# Altium schematic sheet hud_v300_CONN.SchDoc
size A4; SheetNumber: 4; SheetTotal: 6
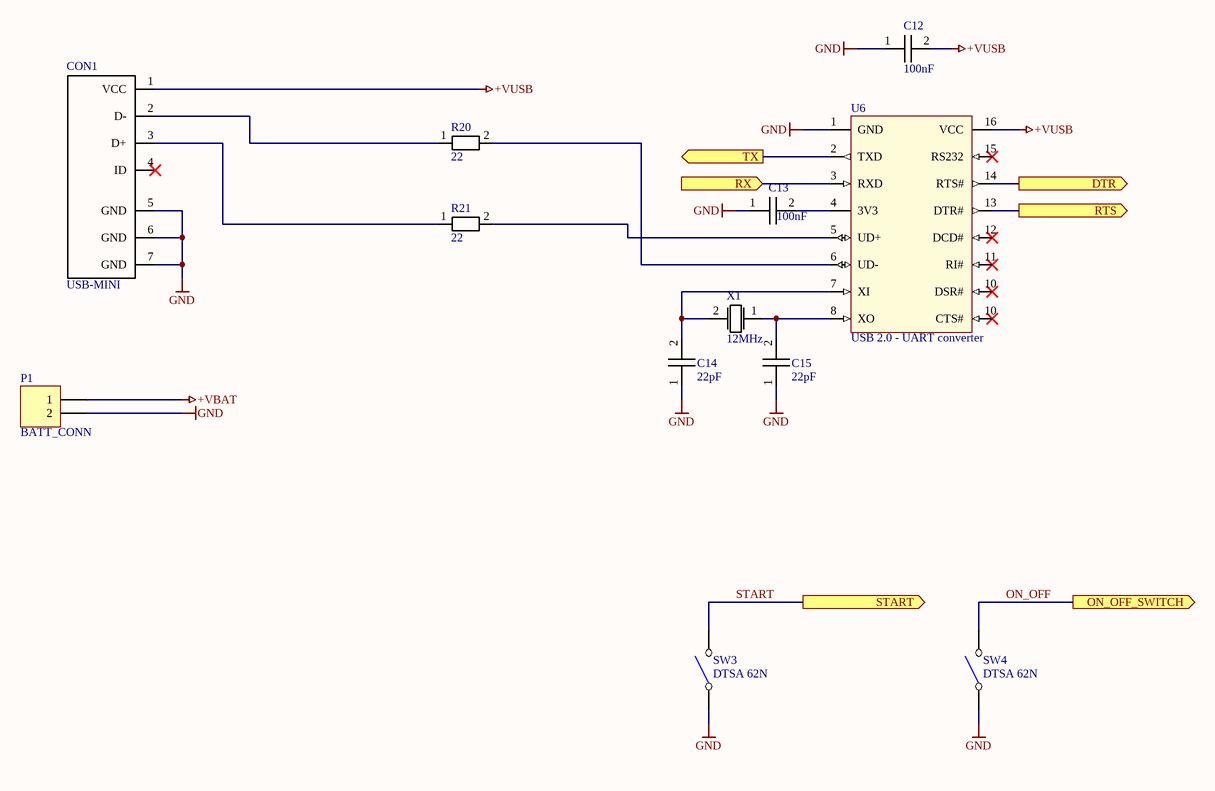
[diagram p0: hud_v300_CONN.SchDoc]

## Parts
C12  100nF  [0805_C]
C13  100nF  [0805_C]
C14  22pF  [0805_C]
C15  22pF  [0805_C]
CON1  USB-MINI  [USB-MINI]
P1  BATT_CONN  [HDR1X2]
R20  22  [0805]
R21  22  [0805]
SW3  DTSA 62N  [SW_DTSA-62N]
SW4  DTSA 62N  [SW_DTSA-62N]
U6  USB 2.0 - UART converter  [SOP127P660X265-16N]
X1  12MHz  [XTAL_SMALL]

## Ports
DTR (out, see hud_v300_MAIN[1B], hud_v300_MCU[2D]), ON_OFF_SWITCH (out, see hud_v300_MAIN[1A]), RTS (out, see hud_v300_MAIN[1B], hud_v300_MCU[2D]), RX (in, see hud_v300_MAIN[1B]), START (out, see hud_v300_MAIN[1B], hud_v300_MCU[4B]), TX (out, see hud_v300_MAIN[1B])

## Nets
+VBAT: P1.1
+VUSB: C12.2 CON1.1(VCC) U6.16(VCC)
GND: C12.1 C13.1 C14.1 C15.1 CON1.5(GND) CON1.6(GND) CON1.7(GND) P1.2 SW3.1 SW4.1 U6.1(GND)
DTR: U6.14(RTS#) ; port DTR
ON_OFF: SW4.2 ; port ON_OFF_SWITCH
RTS: U6.13(DTR#) ; port RTS
RX: U6.3(RXD) ; port RX
START: SW3.2 ; port START
TX: U6.2(TXD) ; port TX
NetC13_2: C13.2 U6.4(3V3)
NetC14_2: C14.2 U6.7(XI) X1.2
NetC15_2: C15.2 U6.8(XO) X1.1
NetCON1_2: CON1.2(D-) R20.1
NetCON1_3: CON1.3(D+) R21.1
NetR20_2: R20.2 U6.6(UD-)
NetR21_2: R21.2 U6.5(UD+)

Not connected (* = marked no-connect by the designer): CON1 4(ID)*; U6 10(DSR#)* 11(RI#)* 12(DCD#)* 15(RS232)*

## Library data of the parts
C12-C15 = CAPACITOR
P1 = Header 2: Header, 2-Pin; LatestRevisionDate: 17-Jul-2002; LatestRevisionNote: Re-released for DXP Platform.; Publisher: Altium Limited
R20 R21 = RESISTOR: Parameter 1: 10k
SW3 SW4 = SW_DTSA 62N
U6 = CH340G: Full-speed USB interface, compatible with USB 2.0 interface / Operates with a minimum amount of external components: a crystal and a minimum of four capacitors
X1 = XTAL